# EAGLE schematic detector328p (EAGLE 7.6.0)

## Sheet 1 of 2
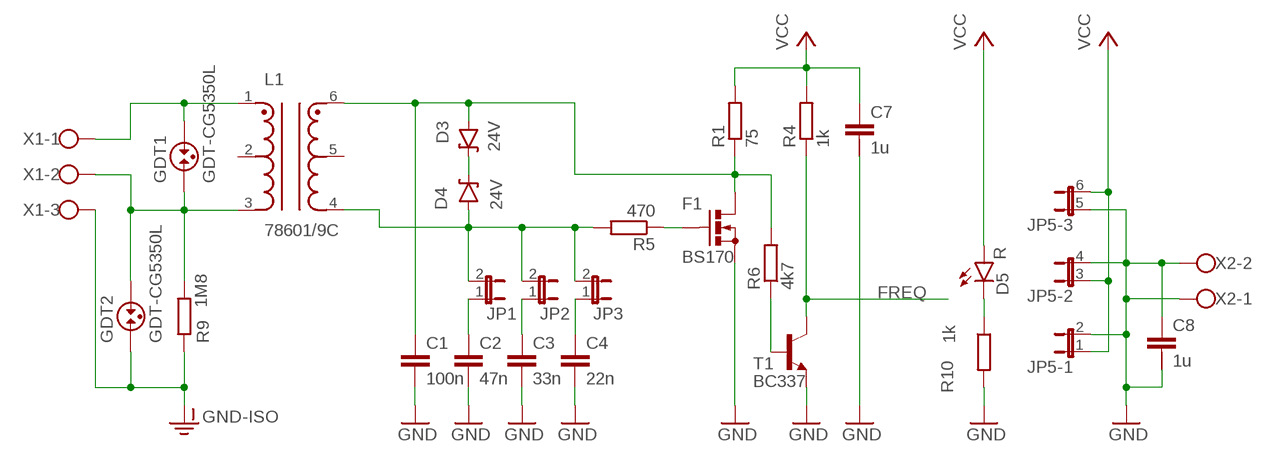
[diagram p0: schematic, sheet 1]

### Parts
C1  100n  C-EU050-024X044  [C050-024X044]
C2  47n  C-EU050-024X044  [C050-024X044]
C3  33n  C-EU050-024X044  [C050-024X044]
C4  22n  C-EU050-024X044  [C050-024X044]
C7  1u  C-2.5-5/4  [C2.5/5-4]
C8  1u  C-2.5-5/4  [C2.5/5-4]
D3  24V  DIODE-ZENER  [DIODE-BZT52]
D4  24V  DIODE-ZENER  [DIODE-BZT52]
D5  R  LED3MM  [LED3MM]
F1  BS170  [SOT54E]
GDT1  GDT-CG5350L  [CG5350L]
GDT2  GDT-CG5350L  [CG5350L]
JP1  JUMPER-2PTH  [1X02]
JP2  JUMPER-2PTH  [1X02]
JP3  JUMPER-2PTH  [1X02]
JP5  JP3QE  [JP3Q]
L1  78601/9C  [78601/9C]
R1  75  R-EU_0204/7  [0204/7]
R4  1k  R-EU_0204/5  [0204/5]
R5  470  R-EU_0204/5  [0204/5]
R6  4k7  R-EU_0204/5  [0204/5]
R9  1M8  R-EU_0204/5  [0204/5]
R10  1k  R-EU_0204/5  [0204/5]
T1  BC337  BC337-NPN-TO92-CBE  [TO92-CBE]
X1  W237-103  [W237-103]
X2  W237-102  [W237-102]

### Nets
FREQ: R4.1 T1.C ; also sheet 2
GND: C1.2 C2.2 C3.2 C4.2 C7.2 C8.1 C8.2 F1.S JP5.2 JP5.4 JP5.5 R10.2 T1.E X2.1 X2.2 ; also sheet 2
GND-ISO: GDT2.1 R9.1 X1.3
N$1: D3.C D4.C
N$2: R6.1 T1.B
N$3: F1.G R5.1
N$4: C3.1 JP2.1
N$5: C4.1 JP3.1
N$6: D4.A JP1.2 JP2.2 JP3.2 L1.4 R5.2
N$7: GDT1.2 L1.1 X1.1
N$11: C2.1 JP1.1
N$14: C1.1 D3.A F1.D L1.6 R1.1 R6.2
N$21: GDT1.1 GDT2.2 L1.3 R9.2 X1.2
N$22: D5.K(C) R10.1
VCC: C7.1 D5.A JP5.1 JP5.3 JP5.6 R1.2 R4.2 ; also sheet 2
Unconnected: C7.3 C8.3 L1.2 L1.5

## Sheet 2 of 2
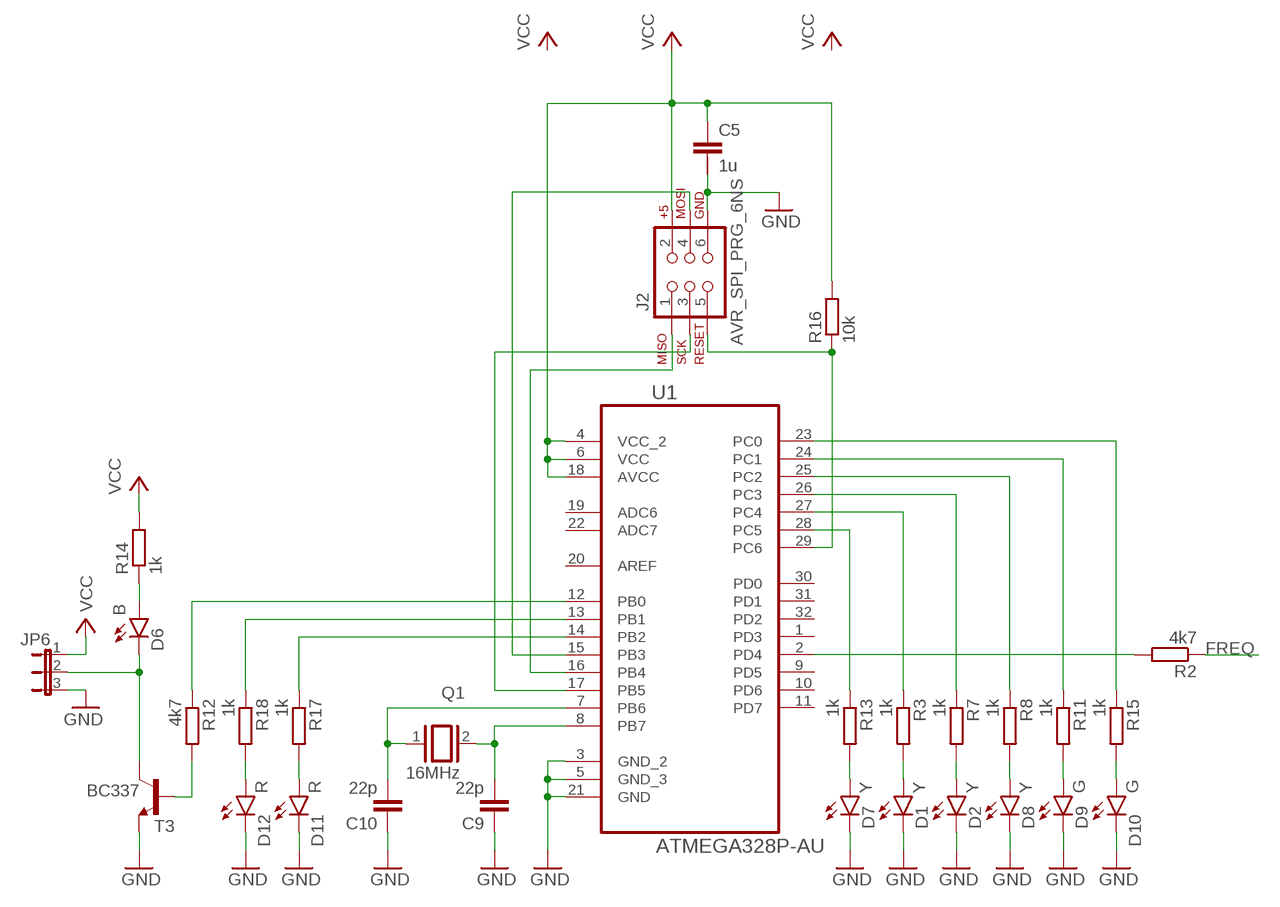
[diagram p1: schematic, sheet 2]

### Parts
C5  1u  C-2.5-5/4  [C2.5/5-4]
C9  22p  C-EU050-024X044  [C050-024X044]
C10  22p  C-EU050-024X044  [C050-024X044]
D1  Y  LED3MM  [LED3MM]
D2  Y  LED3MM  [LED3MM]
D6  B  LED3MM  [LED3MM]
D7  Y  LED3MM  [LED3MM]
D8  Y  LED3MM  [LED3MM]
D9  G  LED3MM  [LED3MM]
D10  G  LED3MM  [LED3MM]
D11  R  LED3MM  [LED3MM]
D12  R  LED3MM  [LED3MM]
J2  AVR_SPI_PRG_6NS  [2X3-NS]
JP6  JP2E  [JP2]
Q1  16MHz  XTAL/S  [QS]
R2  4k7  R-EU_0204/5  [0204/5]
R3  1k  R-EU_0204/5  [0204/5]
R7  1k  R-EU_0204/5  [0204/5]
R8  1k  R-EU_0204/5  [0204/5]
R11  1k  R-EU_0204/5  [0204/5]
R12  4k7  R-EU_0204/5  [0204/5]
R13  1k  R-EU_0204/5  [0204/5]
R14  1k  R-EU_0204/5  [0204/5]
R15  1k  R-EU_0204/5  [0204/5]
R16  10k  R-EU_0204/5  [0204/5]
R17  1k  R-EU_0204/5  [0204/5]
R18  1k  R-EU_0204/5  [0204/5]
T3  BC337  BC337-NPN-TO92-CBE  [TO92-CBE]
U1  ATMEGA328P-AU  [QFP80P900X900X120-32N]

### Nets
FREQ: R2.1 ; also sheet 1
GND: C5.2 C9.1 C10.1 D1.K(C) D2.K(C) D7.K(C) D8.K(C) D9.K(C) D10.K(C) D11.K(C) D12.K(C) J2.6 JP6.3 T3.E U1.3(GND_2) U1.5(GND_3) U1.21(GND) ; also sheet 1
N$8: C10.2 Q1.1 U1.7(PB6)
N$9: R2.2 U1.2(PD4)
N$10: C9.2 Q1.2 U1.8(PB7)
N$12: J2.1 U1.16(PB4)
N$13: J2.4 U1.15(PB3)
N$15: J2.3 U1.17(PB5)
N$16: D1.A R3.2
N$17: D2.A R7.2
N$18: D8.A R8.2
N$19: D9.A R11.2
N$20: R12.2 T3.B
N$23: D6.K(C) JP6.2 T3.C
N$24: D6.A R14.1
N$25: R13.1 U1.28(PC5)
N$26: R3.1 U1.27(PC4)
N$27: D7.A R13.2
N$28: R7.1 U1.26(PC3)
N$29: R8.1 U1.25(PC2)
N$30: J2.5 R16.1 U1.29(PC6)
N$31: R11.1 U1.24(PC1)
N$32: D10.A R15.2
N$33: R15.1 U1.23(PC0)
N$34: D11.A R17.2
N$35: D12.A R18.2
N$36: R17.1 U1.14(PB2)
N$37: R18.1 U1.13(PB1)
N$38: R12.1 U1.12(PB0)
VCC: C5.1 J2.2 JP6.1 R14.2 R16.2 U1.4(VCC_2) U1.6(VCC) U1.18(AVCC) ; also sheet 1
Unconnected: C5.3 U1.1(PD3) U1.9(PD5) U1.10(PD6) U1.11(PD7) U1.19(ADC6) U1.20(AREF) U1.22(ADC7) U1.30(PD0) U1.31(PD1) U1.32(PD2)

## Library data of the parts
C1-C4 C9 C10 = resistor:C-EU: CAPACITOR, European symbol
C5 C7 C8 = capacitor-wima:C-: CAPACITOR for alternative placement naming: default grid - extended grid/package width
D1 D2 D5-D12 = SparkFun-LED:LED: LEDs Standard schematic elements and footprints for 5mm, 3mm, 1206, and 0603 sized LEDs. 5mm - Spark Fun Electronics SKU : COM-00529 (and others); PROD_ID: DIO-08794
D3 D4 = SparkFun-DiscreteSemi:DIODE-ZENER: Zener Diode Production Part - 8199 3.4V Zener Voltage; PROD-ID: DIO-08199; VALUE: BZT52
F1 = transistor-small-signal:BS170: N-CHANNEL MOS FET
GDT1 GDT2 = supressor:GDT-: GAS DISCHARGE TUBE
J2 = SparkFun-Connectors:AVR_SPI_PRG_6: AVR ISP 6 Pin This is the reduced ISP connector for AVR programming. Common on Arduino. This footprint will take up less PCB space and can be used with a 10-pin to 6-pin adapter such as SKU: BOB-08508 **Special note about "TEST_POINT" package. The stop mask is on the top side, so if you want your programming test points to be on the bottom of your board, make sure to place this package on the bottom side of the board. This also ensure that the orientation to program from the bottom side will be correct.
JP1-JP3 = SparkFun-Retired:JUMPER-2: Jumper Basic 0.1" spaced jumper. Use with breakaway headers.
JP5 = jumper:JP3QE: JUMPER
JP6 = jumper:JP2E: JUMPER
L1 = detector:78601/9C: MuRata 78601/9C
Q1 = special:XTAL/S: CRYSTAL
R1-R18 = resistor:R-EU_: RESISTOR, European symbol
T1 T3 = transistor:*-NPN-: NPN Transistror BF959 corrected 2008.03.06
U1 = Atmel_By_element14_Batch_1-00:ATMEGA328P-AU: 8-bit Microcontroller with In-System Programmable Flash; MPN: ATMEGA328P-AU; OC_FARNELL: 1715486; OC_NEWARK: 14R4631; PACKAGE: TQFP-32; SUPPLIER: Atmel
X1 = con-wago-500:W237-103: WAGO SCREW CLAMP; MPN: 237-103; OC_FARNELL: unknown; OC_NEWARK: 18M7116
X2 = con-wago-500:W237-102: WAGO SCREW CLAMP; MPN: 237-102; OC_FARNELL: unknown; OC_NEWARK: 70K9898